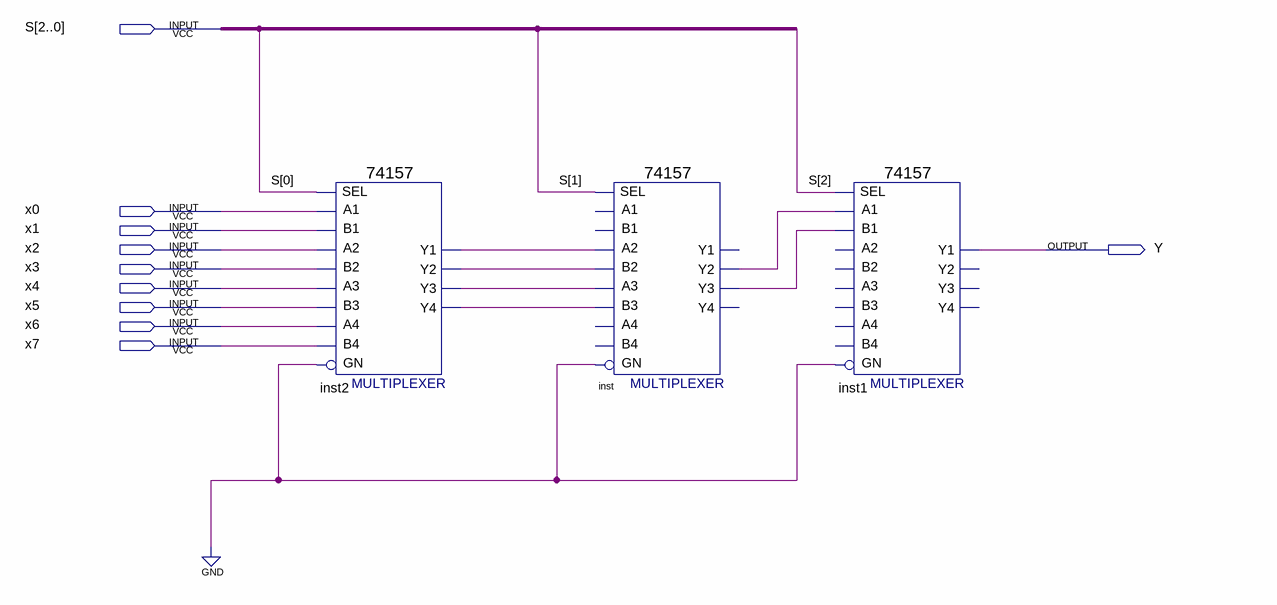
[diagram p0: schematic sheet]
// Quartus schematic ex1.bdf as structural Verilog: 3 symbols, 10 pins
module ex1 (
  input  [2:0] S,
  input  x0,
  input  x1,
  input  x2,
  input  x3,
  input  x4,
  input  x5,
  input  x6,
  input  x7,
  output Y
);

  wire inst2_y1, inst2_y2, inst2_y3, inst2_y4, inst_y2, inst_y3;

  \74157  inst2 (
    .A1(x0), .B1(x1), .SEL(S[0]), .B2(x3), .A3(x4), .B3(x5), .A2(x2), .B4(x7), .GN(1'b0), .A4(x6),
    .Y2(inst2_y2), .Y1(inst2_y1), .Y4(inst2_y4), .Y3(inst2_y3));
  \74157  inst (
    .SEL(S[1]), .B2(inst2_y2), .A3(inst2_y3), .B3(inst2_y4), .A2(inst2_y1), .GN(1'b0), .Y2(inst_y2),
    .Y3(inst_y3));  // open: A1, B1, B4, A4, Y1, Y4
  \74157  inst1 (
    .A1(inst_y2), .B1(inst_y3), .SEL(S[2]), .GN(1'b0), .Y1(Y));  // open: B2, A3, B3, A2, B4, A4, Y2, Y4, Y3
endmodule
